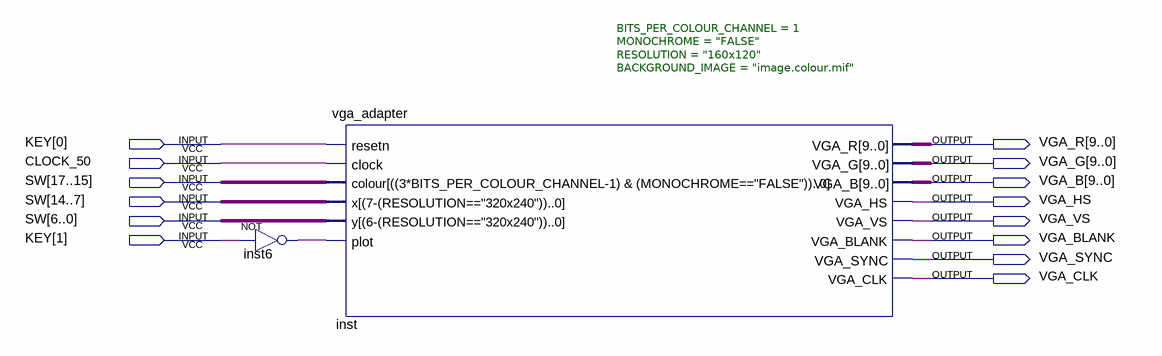
[diagram p0: schematic sheet]
// Quartus schematic vga_demo.bdf as structural Verilog: 2 symbols, 14 pins
module vga_demo (
  input  [1:0] KEY,
  input  CLOCK_50,
  input  [17:0] SW,
  output [9:0] VGA_R,
  output [9:0] VGA_G,
  output [9:0] VGA_B,
  output VGA_HS,
  output VGA_VS,
  output VGA_BLANK,
  output VGA_SYNC,
  output VGA_CLK
);

  wire inst6_out;

  not inst6 (inst6_out, KEY[1]);
  vga_adapter #(.BITS_PER_COLOUR_CHANNEL(1), .MONOCHROME("FALSE"), .RESOLUTION("160x120"), .BACKGROUND_IMAGE("image.colour.mif")) inst (
    .resetn(KEY[0]), .clock(CLOCK_50), .plot(inst6_out), .x(SW[14:7]), .y(SW[6:0]), .colour(SW[17:15]),
    .VGA_R(VGA_R), .VGA_G(VGA_G), .VGA_B(VGA_B), .VGA_HS(VGA_HS), .VGA_VS(VGA_VS), .VGA_BLANK(VGA_BLANK),
    .VGA_SYNC(VGA_SYNC), .VGA_CLK(VGA_CLK));
endmodule
